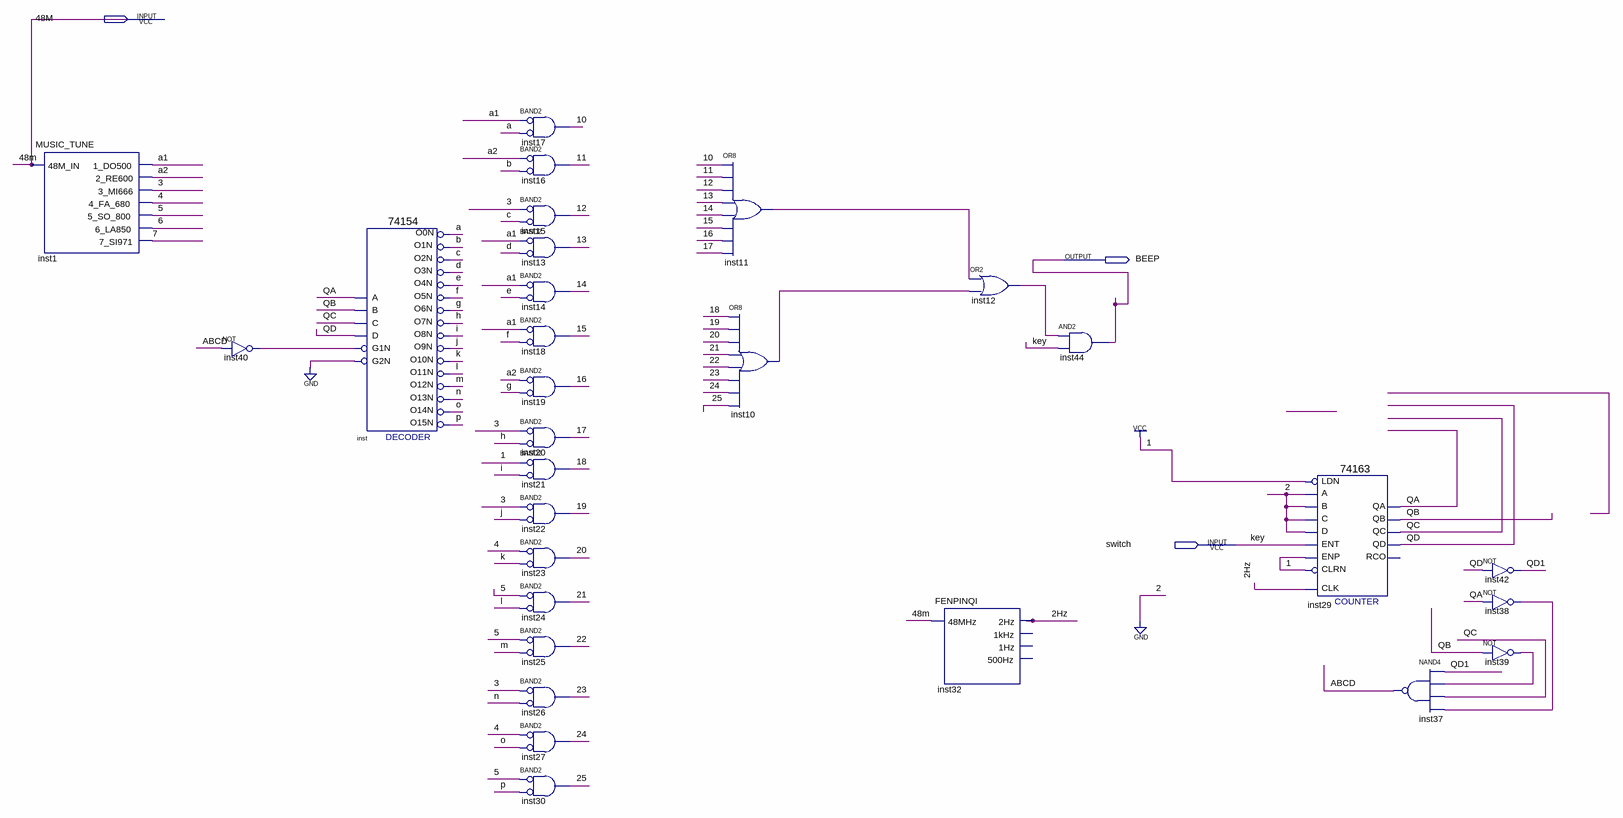
[diagram p0: schematic sheet]
// Quartus schematic laohu.bdf as structural Verilog: 29 symbols, 3 pins
module laohu (
  input  \48M ,
  input  switch,
  output BEEP
);

  wire \2Hz , \3 , \4 , \5 , \6 , \7 , \10 , \11 , \12 , \13 , \14 , \15 , \16 , \17 , \18 , \19 , \20 ,
       \21 , \22 , \23 , \24 , \25 , a, a1, a2, ABCD, b, c, d, e, f, g, h, i, inst10_out, inst11_out,
       inst12_out, inst38_out, inst39_out, inst40_out, j, k, l, m, n, o, p, QA, QB, QC, QD, QD1;

  MUSIC_TUNE inst1 (
    .\48M_IN (\48M ), .\1_DO500 (a1), .\2_RE600 (a2), .\3_MI666 (\3 ), .\4_FA_680 (\4 ), .\5_SO_800 (\5 ),
    .\6_LA850 (\6 ), .\7_SI971 (\7 ));
  not inst40 (inst40_out, ABCD);
  \74154  inst (
    .C(QC), .D(QD), .B(QB), .A(QA), .G1N(inst40_out), .G2N(1'b0), .O0N(a), .O12N(m), .O15N(p), .O10N(k),
    .O11N(l), .O1N(b), .O13N(n), .O14N(o), .O4N(e), .O3N(d), .O2N(c), .O7N(h), .O6N(g), .O5N(f), .O9N(j),
    .O8N(i));
  and inst17 (\10 , ~a1, ~a);  // BAND2
  and inst16 (\11 , ~a2, ~b);  // BAND2
  and inst15 (\12 , ~\3 , ~c);  // BAND2
  and inst13 (\13 , ~a1, ~d);  // BAND2
  and inst14 (\14 , ~a1, ~e);  // BAND2
  and inst18 (\15 , ~a1, ~f);  // BAND2
  and inst19 (\16 , ~a2, ~g);  // BAND2
  and inst20 (\17 , ~\3 , ~h);  // BAND2
  and inst21 (\18 , ~1'b1, ~i);  // BAND2
  and inst22 (\19 , ~\3 , ~j);  // BAND2
  and inst23 (\20 , ~\4 , ~k);  // BAND2
  and inst24 (\21 , ~\5 , ~l);  // BAND2
  and inst25 (\22 , ~\5 , ~m);  // BAND2
  and inst26 (\23 , ~\3 , ~n);  // BAND2
  and inst27 (\24 , ~\4 , ~o);  // BAND2
  and inst30 (\25 , ~\5 , ~p);  // BAND2
  or inst11 (inst11_out, \10 , \11 , \12 , \13 , \14 , \15 , \16 , \17 );
  or inst10 (inst10_out, \18 , \19 , \20 , \21 , \22 , \23 , \24 , \25 );
  or inst12 (inst12_out, inst11_out, inst10_out);
  FENPINQI inst32 (.\48MHz (\48M ), .\2Hz (\2Hz ));  // open: 1kHz, 1Hz, 500Hz
  and inst44 (BEEP, inst12_out, switch);
  \74163  inst29 (
    .C(1'b0), .B(1'b0), .A(1'b0), .ENT(switch), .D(1'b0), .CLRN(1'b1), .CLK(\2Hz ), .ENP(1'b1), .LDN(1'b1),
    .QA(QA), .QB(QB), .QC(QC), .QD(QD));  // open: RCO
  nand inst37 (ABCD, QD1, inst39_out, QC, inst38_out);
  not inst42 (QD1, QD);
  not inst38 (inst38_out, QA);
  not inst39 (inst39_out, QB);

  // Other names for the same wires on the sheet: key = switch
endmodule
